# Altium schematic sheet P2_AudioInput.SchDoc
size 254 x 241 mm
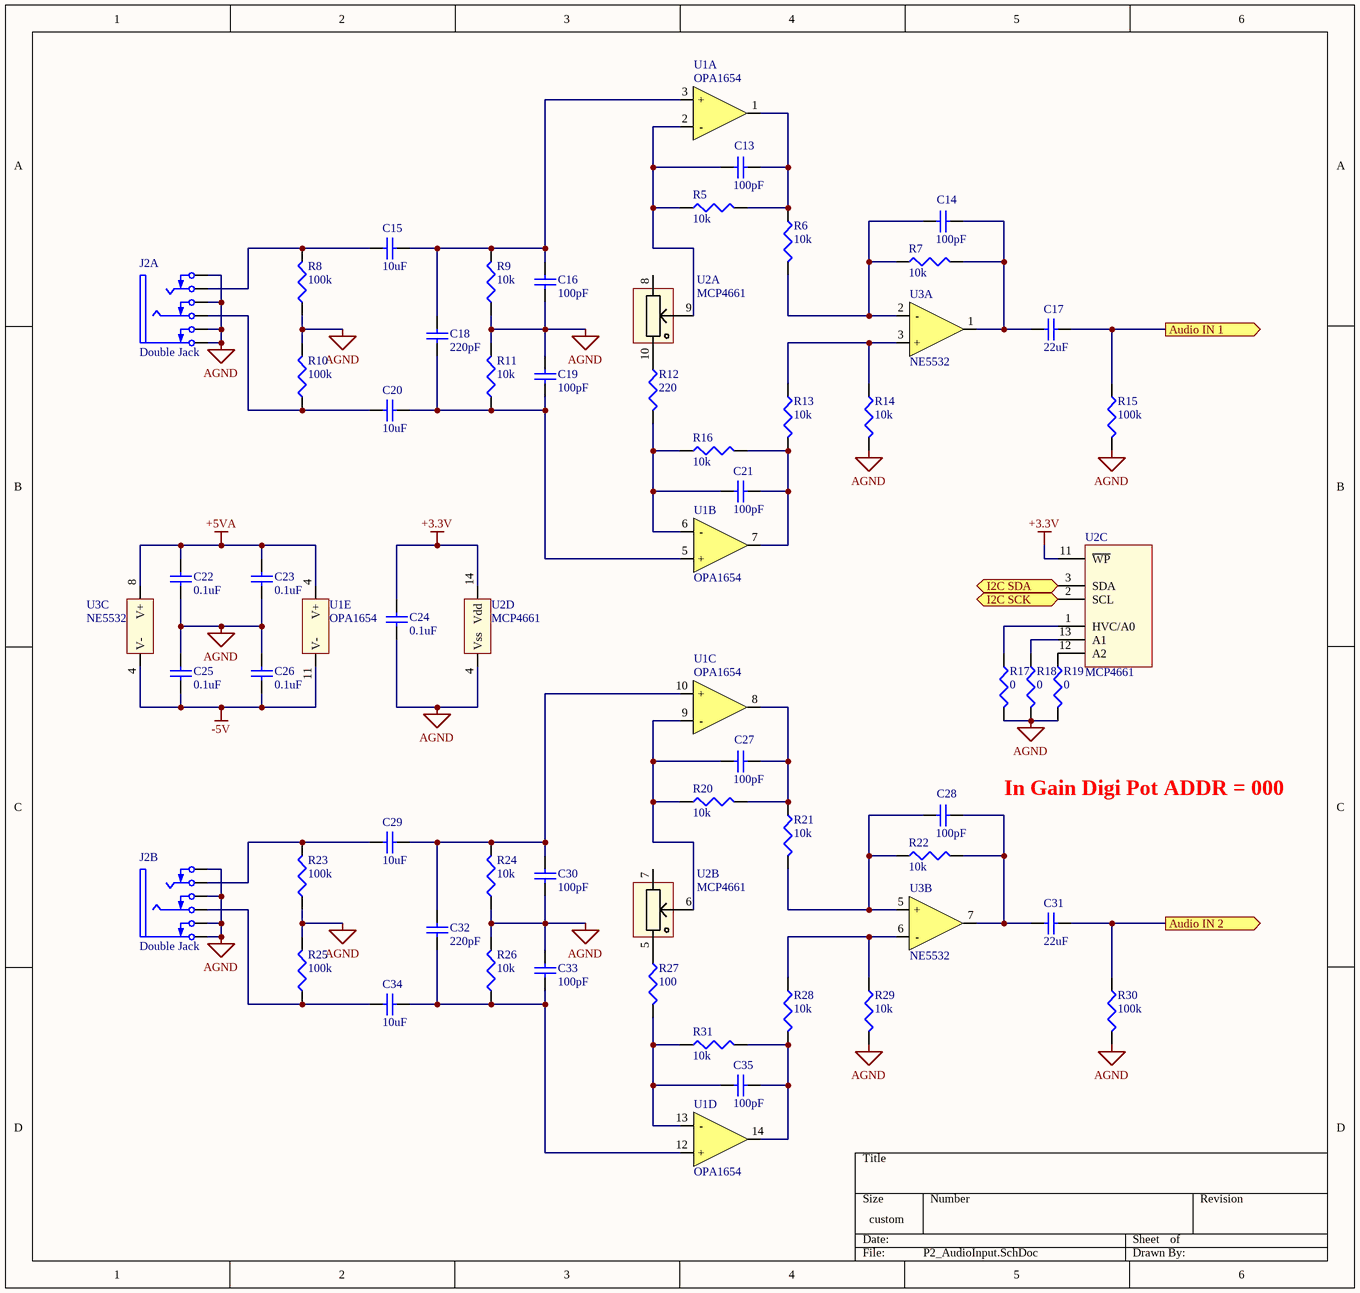
[diagram p0: P2_AudioInput.SchDoc]

## Parts
C13  100pF  [CAP 0603 (1608 metric)]
C14  100pF  [CAP 0603 (1608 metric)]
C15  10uF  [CAP 0603 (1608 metric)]
C16  100pF  [CAP 0603 (1608 metric)]
C17  22uF  [CAP 0603 (1608 metric)]
C18  220pF  [CAP 0603 (1608 metric)]
C19  100pF  [CAP 0603 (1608 metric)]
C20  10uF  [CAP 0603 (1608 metric)]
C21  100pF  [CAP 0603 (1608 metric)]
C22  0.1uF  [CAP 0603 (1608 metric)]
C23  0.1uF  [CAP 0603 (1608 metric)]
C24  0.1uF  [CAP 0603 (1608 metric)]
C25  0.1uF  [CAP 0603 (1608 metric)]
C26  0.1uF  [CAP 0603 (1608 metric)]
C27  100pF  [CAP 0603 (1608 metric)]
C28  100pF  [CAP 0603 (1608 metric)]
C29  10uF  [CAP 0603 (1608 metric)]
C30  100pF  [CAP 0603 (1608 metric)]
C31  22uF  [CAP 0603 (1608 metric)]
C32  220pF  [CAP 0603 (1608 metric)]
C33  100pF  [CAP 0603 (1608 metric)]
C34  10uF  [CAP 0603 (1608 metric)]
C35  100pF  [CAP 0603 (1608 metric)]
J2  Double Jack  (parts A,B of 2)
R5  10k  [RES 0603 (1608 metric)]
R6  10k  [RES 0603 (1608 metric)]
R7  10k  [RES 0603 (1608 metric)]
R8  100k  [RES 0603 (1608 metric)]
R9  10k  [RES 0603 (1608 metric)]
R10  100k  [RES 0603 (1608 metric)]
R11  10k  [RES 0603 (1608 metric)]
R12  220  [RES 0603 (1608 metric)]
R13  10k  [RES 0603 (1608 metric)]
R14  10k  [RES 0603 (1608 metric)]
R15  100k  [RES 0603 (1608 metric)]
R16  10k  [RES 0603 (1608 metric)]
R17  0  [RES 0603 (1608 metric)]
R18  0  [RES 0603 (1608 metric)]
R19  0  [RES 0603 (1608 metric)]
R20  10k  [RES 0603 (1608 metric)]
R21  10k  [RES 0603 (1608 metric)]
R22  10k  [RES 0603 (1608 metric)]
R23  100k  [RES 0603 (1608 metric)]
R24  10k  [RES 0603 (1608 metric)]
R25  100k  [RES 0603 (1608 metric)]
R26  10k  [RES 0603 (1608 metric)]
R27  100  [RES 0603 (1608 metric)]
R28  10k  [RES 0603 (1608 metric)]
R29  10k  [RES 0603 (1608 metric)]
R30  100k  [RES 0603 (1608 metric)]
R31  10k  [RES 0603 (1608 metric)]
U1  OPA1654  (parts A,B,C,D,E of 5)
U2  MCP4661  (parts A,B,C,D of 4)
U3  NE5532  (parts A,B,C of 3)

## Ports
Audio IN 1 (out), Audio IN 2 (out), I2C SCK, I2C SDA

## Nets
+3.3V: C24.1 U2.11(~{WP}) U2.14(Vdd)
+5VA: C22.1 C23.1 U1.4(V+) U3.8(V+)
-5V: C25.2 C26.2 U1.11(V-) U3.4(V-)
AGND: C16.2 C19.1 C22.2 C23.2 C24.2 C25.1 C26.1 C30.2 C33.1 J2.1(SB) J2.2(RB) J2.3(TB) J2.4(S) J2.7(SB) J2.8(RB) J2.9(TB) J2.10(S) R8.1 R9.1 R10.2 R11.2 R14.2 R15.2 R17.2 R18.2 R19.2 R23.1 R24.1 R25.2 R26.2 R29.2 R30.2 U2.4(Vss)
Audio IN 1: C17.1 R15.1 ; port Audio IN 1
Audio IN 2: C31.1 R30.1 ; port Audio IN 2
I2C SCK: U2.2(SCL) ; port I2C SCK
I2C SDA: U2.3(SDA) ; port I2C SDA
NetC13_1: C13.1 R5.1 U1.2(-) U2.9(P0W)
NetC13_2: C13.2 R5.2 R6.1 U1.1(OUT)
NetC14_1: C14.1 R6.2 R7.1 U3.2(-)
NetC14_2: C14.2 C17.2 R7.2 U3.1(OUT)
NetC15_1: C15.1 C16.1 C18.1 R9.2 U1.3(+)
NetC15_2: C15.2 J2.12(T) R8.2
NetC18_2: C18.2 C19.2 C20.1 R11.1 U1.5(+)
NetC20_2: C20.2 J2.11(R) R10.1
NetC21_1: C21.1 R12.2 R16.1 U1.6(-)
NetC21_2: C21.2 R13.2 R16.2 U1.7(OUT)
NetC27_1: C27.1 R20.1 U1.9(-) U2.6(P1W)
NetC27_2: C27.2 R20.2 R21.1 U1.8(OUT)
NetC28_1: C28.1 R21.2 R22.1 U3.5(+)
NetC28_2: C28.2 C31.2 R22.2 U3.7(OUT)
NetC29_1: C29.1 C30.1 C32.1 R24.2 U1.10(+)
NetC29_2: C29.2 J2.6(T) R23.2
NetC32_2: C32.2 C33.2 C34.1 R26.1 U1.12(+)
NetC34_2: C34.2 J2.5(R) R25.1
NetC35_1: C35.1 R27.2 R31.1 U1.13(-)
NetC35_2: C35.2 R28.2 R31.2 U1.14(OUT)
NetR12_1: R12.1 U2.10(P0B)
NetR13_1: R13.1 R14.1 U3.3(+)
NetR17_1: R17.1 U2.1(HVC/A0)
NetR18_1: R18.1 U2.13(A1)
NetR19_1: R19.1 U2.12(A2)
NetR27_1: R27.1 U2.5(P1B)
NetR28_1: R28.1 R29.1 U3.6(-)

Not connected (* = marked no-connect by the designer): U2 7(P1A) 8(P0A)

## Notes on the sheet
- In Gain Digi Pot ADDR = 000

## Library data of the parts
C13-C35 = Cap Semi: Capacitor (Semiconductor SIM Model)
  C13 C14 C16 C19 C21 C27 C28 C30 C33 C35: Value: 100pF
  C15 C20 C29 C34: Value: 10uF
  C17 C31: Value: 22uF
  C18 C32: Value: 220pF
  C22-C26: Value: 0.1uF
J2 = Dual TRS Jack Bypassed: Dual Jack stereo bypassed
R5-R31 = Res3: Resistor
  R5-R7 R9 R11 R13 R14 R16 R20-R22 R24 R26 R28 R29 R31: Value: 10k
  R8 R10 R15 R23 R25 R30: Value: 100k
  R12: Value: 220
  R17-R19: Value: 0
  R27: Value: 100
U1 = OPA1654: Quad Audio OpAmp
U2 = MCP4661: Dual DigiPot non volatile I2C
U3 = NE5532: Dual Audio OpAmp